# Altium project PID_controller.PrjPcb
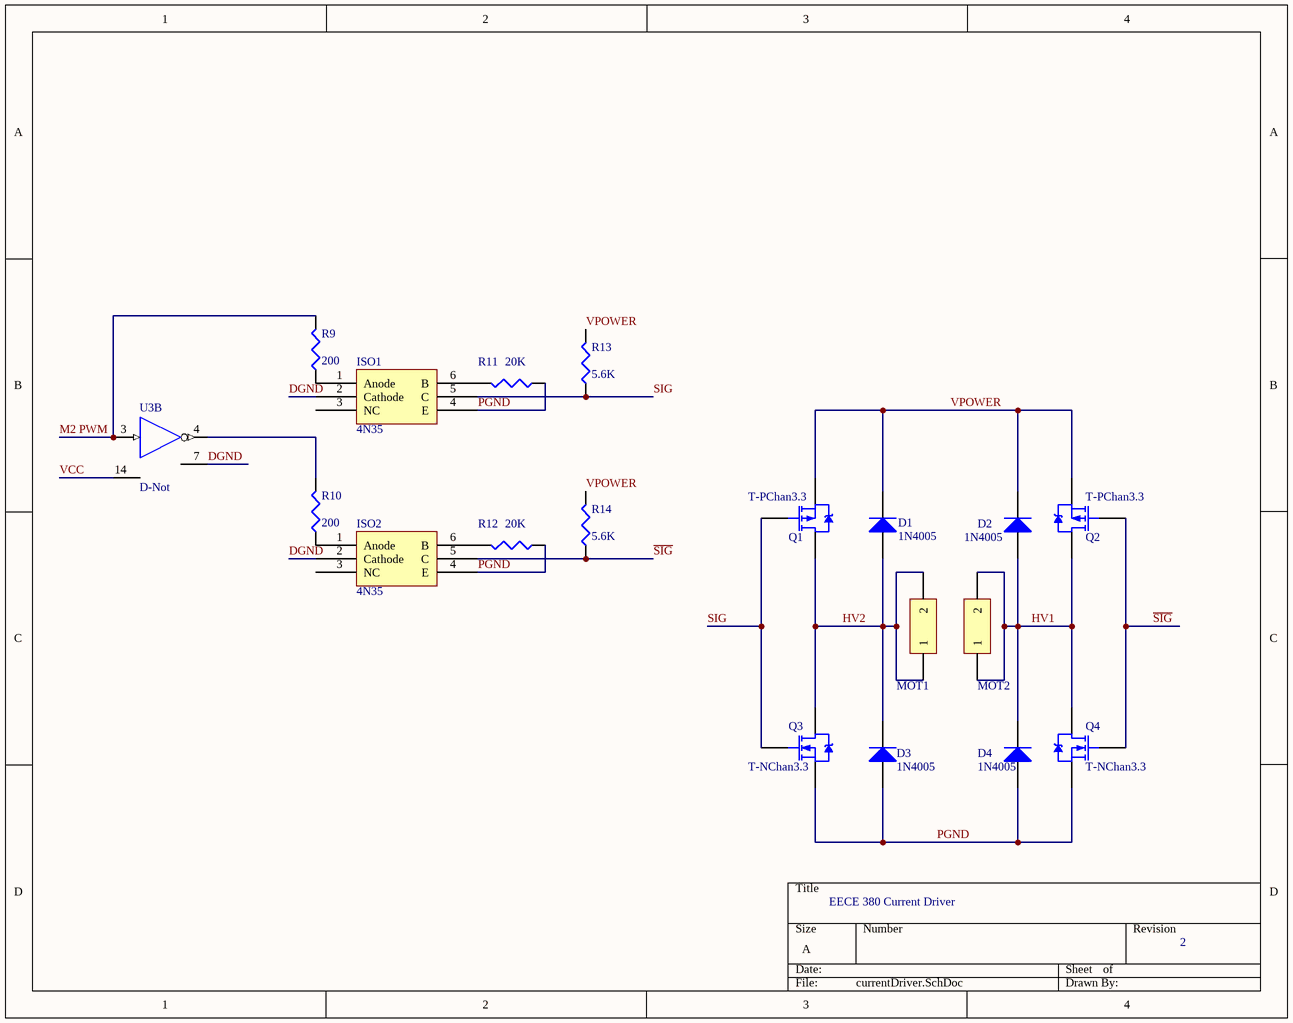
[diagram p0: currentDriver.SchDoc]
3 sheets, 45 parts. Net scope: global (net labels, ports and power ports of the same name join across sheets).
Board file: motherboard2.PcbDoc
Sheets:
  currentDriver.SchDoc
  opticalDecoder.SchDoc
  motherboard2.SchDoc

## Sheet currentDriver.SchDoc
size A

### Parts
D1  1N4005  [DO-41_XLGE1.2]
D2  1N4005  [DO-41_XLGE1.2]
D3  1N4005  [DO-41_XLGE1.2]
D4  1N4005  [DO-41_XLGE1.2]
ISO1  4N35  [DIP6LGE]
ISO2  4N35  [DIP6LGE]
MOT1  C-Ban  [Ban1cm_2XLGE1.5]  (value not drawn)
MOT2  Ban  [Ban1cm_2XLGE1.5]  (value not drawn)
Q1  T-PChan3.3  [TO-220AB]
Q2  T-PChan3.3  [TO-220AB]
Q3  T-NChan3.3  [TO-220AB]
Q4  T-NChan3.3  [TO-220AB]
R9  value 200  [Res10mm_LGE1.0]  (hidden comment: -Res)
R10  value 200  [Res10mm_LGE1.0]
R11  value 20K  [Res10mm_LGE1.0]  (hidden comment: G-Res)
R12  value 20K  [Res10mm_LGE1.0]  (hidden comment: G-Res)
R13  value 5.6K  [Res10mm_LGE1.0]  (hidden comment: G-Res)
R14  value 5.6K  [Res10mm_LGE1.0]  (hidden comment: G-Res)
U3  D-Not  [DIP14_LGE1.0]  (part B of 6)

### Nets
DGND: ISO1.2(Cathode) ISO2.2(Cathode) U3.7(GND)
HV1: D2.1(A) D4.2(K) MOT2.1 MOT2.2 Q2.2(D) Q4.2(D)
HV2: D1.1(A) D3.2(K) MOT1.1 MOT1.2 Q1.2(D) Q3.2(D)
M2 PWM: R9.2 U3.3(A)
PGND: D3.1(A) D4.1(A) ISO1.4(E) ISO2.4(E) Q3.3(S) Q4.3(S) R11.1 R12.1
~{SIG}: ISO2.5(C) Q2.1(G) Q4.1(G) R14.1
SIG: ISO1.5(C) Q1.1(G) Q3.1(G) R13.1
VCC: U3.14(VCC)  [project net V1]
VPOWER: D1.2(K) D2.2(K) Q1.3(S) Q2.3(S) R13.2 R14.2
NetISO1_1: ISO1.1(Anode) R9.1
NetISO1_6: ISO1.6(B) R11.2
NetISO2_1: ISO2.1(Anode) R10.1
NetISO2_6: ISO2.6(B) R12.2
NetR10_2: R10.2 U3.4(Y)

Not connected (* = marked no-connect by the designer): ISO1 3(NC); ISO2 3(NC)

### Notes on the sheet
- EECE 380 Current Driver
- 2

### Library data of the parts
D1-D4 = T-Diode-1N4005: diode; Published: 8-Jun-2000; LatestRevisionDate: 17-Jul-2002; LatestRevisionNote: Re-released for DXP Platform.; DatasheetDocument: 1998; PackageDocument: Aug-1999; PackageReference: DO-41; Publisher: Altium Limited; Code_JEDEC: DO-204-AL; ComponentLink1Description: Manufacturer Link; ComponentLink1URL: http://www.fairchildsemi.com/; ComponentLink2Description: Pinout Specification; ComponentLink2URL: http://www.fairchildsemi.com/ds/1N%2F1N4001.pdf
MOT1 MOT2 = C-Ban: Banana plug fem; LatestRevisionDate: 17-Jul-2002; LatestRevisionNote: Re-released for DXP Platform.; Publisher: Altium Limited
Q1 Q2 = T-PChan3.3: P-Channel Power MOSFET; Note: Pin 4 not drawn and electrically connected to Pin 2.; Published: 4-Nov-2002; PackageReference: TO-220AB; PackageDescription: TO, Thru-Hole, Vertical, Heatsink Mounted; 3 In-Line Leads; Pitch 2.54 mm; ComponentLink1URL: https://www.fairchildsemi.com/products/discretes/fets/mosfets/FQP7P06.html?keyword=FQP7P06
Q3 Q4 = T-NChan3.3: N-Channel Power MOSFET; Note: Pin 2 is electrically connected to pin 4.; Published: 23-Jan-2015; LatestRevisionDate: 23-Jan-2015; PackageReference: TO-220AB; PackageDescription: TO, Thru-Hole, Vertical, Heatsink Mounted; 3 In-Line Leads; Pitch 2.54 mm; ComponentLink1URL: http://www.vishay.com/product?docid=91023#psplib
R9-R14 = G-Res: resistor (specify value); Published: 8-Jun-2000; LatestRevisionDate: 29-May-2009; LatestRevisionNote: IPC-7351 Footprint Added.; PackageReference: J1-0603; Publisher: Altium Limited; PackageDescription: Chip Resistor
U3 = D-Not: hex NOT gate (inverter); Published: 8-Jun-2000; LatestRevisionDate: 04-Mar-2005; LatestRevisionNote: Stylized 3D Model Added.; DatasheetVersion: Mar-1988; PackageVersion: Oct-1995; PackageReference: N014; Publisher: Altium Limited; PackageDescription: DIP; 14 Leads; Row Spacing 7.62 mm; Pitch 2.54 mm; ComponentLink1Description: Manufacturer Link; ComponentLink1URL: http://www.ti.com/; ComponentLink2Description: Datasheet; ComponentLink2URL: http://www-s.ti.com/sc/ds/sn74ls04.pdf

## Sheet opticalDecoder.SchDoc
size A4
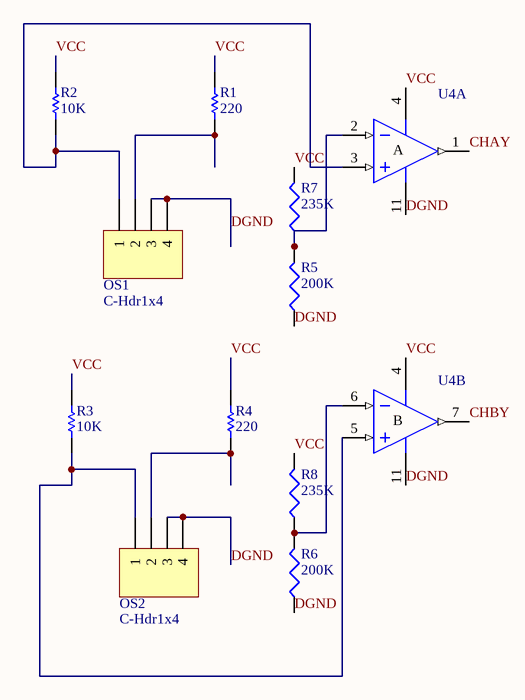
[diagram p1: opticalDecoder.SchDoc]

### Parts
OS1  C-Hdr1x4  [HDR1X4_LGE1.0]
OS2  C-Hdr1x4  [HDR1X4_LGE1.0]
R1  220  [Res10mm_LGE1.0]
R2  10K  [Res10mm_LGE1.0]
R3  10K  [Res10mm_LGE1.0]
R4  220  [Res10mm_LGE1.0]
R5  200K  [Res10mm_LGE1.0]
R6  200K  [Res10mm_LGE1.0]
R7  235K  [Res10mm_LGE1.0]
R8  235K  [Res10mm_LGE1.0]
U4  O-OpAmp074  [DIP14_LGE1.0]  (value not drawn)  (parts A,B of 4)

### Nets
CHAY: U4.1(OUT)
CHBY: U4.7(OUT)
DGND: OS1.3 OS1.4 OS2.3 OS2.4 R5.1 R6.1 U4.11(V-)
VCC: R1.2 R2.2 R3.2 R4.2 R7.2 R8.2 U4.4(V+)  [project net V1]
NetOS1_1: OS1.1 R2.1 U4.3(IN+)
NetOS1_2: OS1.2 R1.1
NetOS2_1: OS2.1 R3.1 U4.5(IN+)
NetOS2_2: OS2.2 R4.1
NetR5_2: R5.2 R7.1 U4.2(IN-)
NetR6_2: R6.2 R8.1 U4.6(IN-)

### Notes on the sheet
- (in symbol O-OpAmp074, part A) A
- (in symbol O-OpAmp074, part B) B

### Library data of the parts
OS1 OS2 = C-Hdr1x4: Header, 4-Pin; LatestRevisionDate: 17-Jul-2002; LatestRevisionNote: Re-released for DXP Platform.; Publisher: Altium Limited
R1-R4 = Res1: Resistor; Published: 8-Jun-2000; LatestRevisionDate: 17-Jul-2002; LatestRevisionNote: Re-released for DXP Platform.; PackageReference: AXIAL-0.3; Publisher: Altium Limited; PackageDescription: Axial Device, Thru-Hole; 2 Leads; 0.3 in Pin Spacing
  R1 R4: Value: 220
  R2 R3: Value: 10K
R5-R8 = G-Res: resistor (specify value); Published: 8-Jun-2000; LatestRevisionDate: 29-May-2009; LatestRevisionNote: IPC-7351 Footprint Added.; PackageReference: J1-0603; Publisher: Altium Limited; PackageDescription: Chip Resistor
  R5 R6: Value: 200K
  R7 R8: Value: 235K
U4 = O-OpAmp074: op amp (TL074); Published: 24-Aug-2001; LatestRevisionDate: 06-Jun-2005; LatestRevisionNote: Stylized 3D Model Added.; DatasheetVersion: Dec-1998; PackageVersion: Jan-1997; PackageReference: DIP14; Publisher: Altium Limited; PackageDescription: DIP; 14 Leads; Row Spacing 7.62 mm; Pitch 2.54 mm; ComponentLink1Description: Manufacturer Link; ComponentLink1URL: http://www.st.com/; ComponentLink2Description: Datasheet; ComponentLink2URL: http://www.st.com/stonline/products/literature/ds/2297/tl074.pdf

## Sheet motherboard2.SchDoc
size A
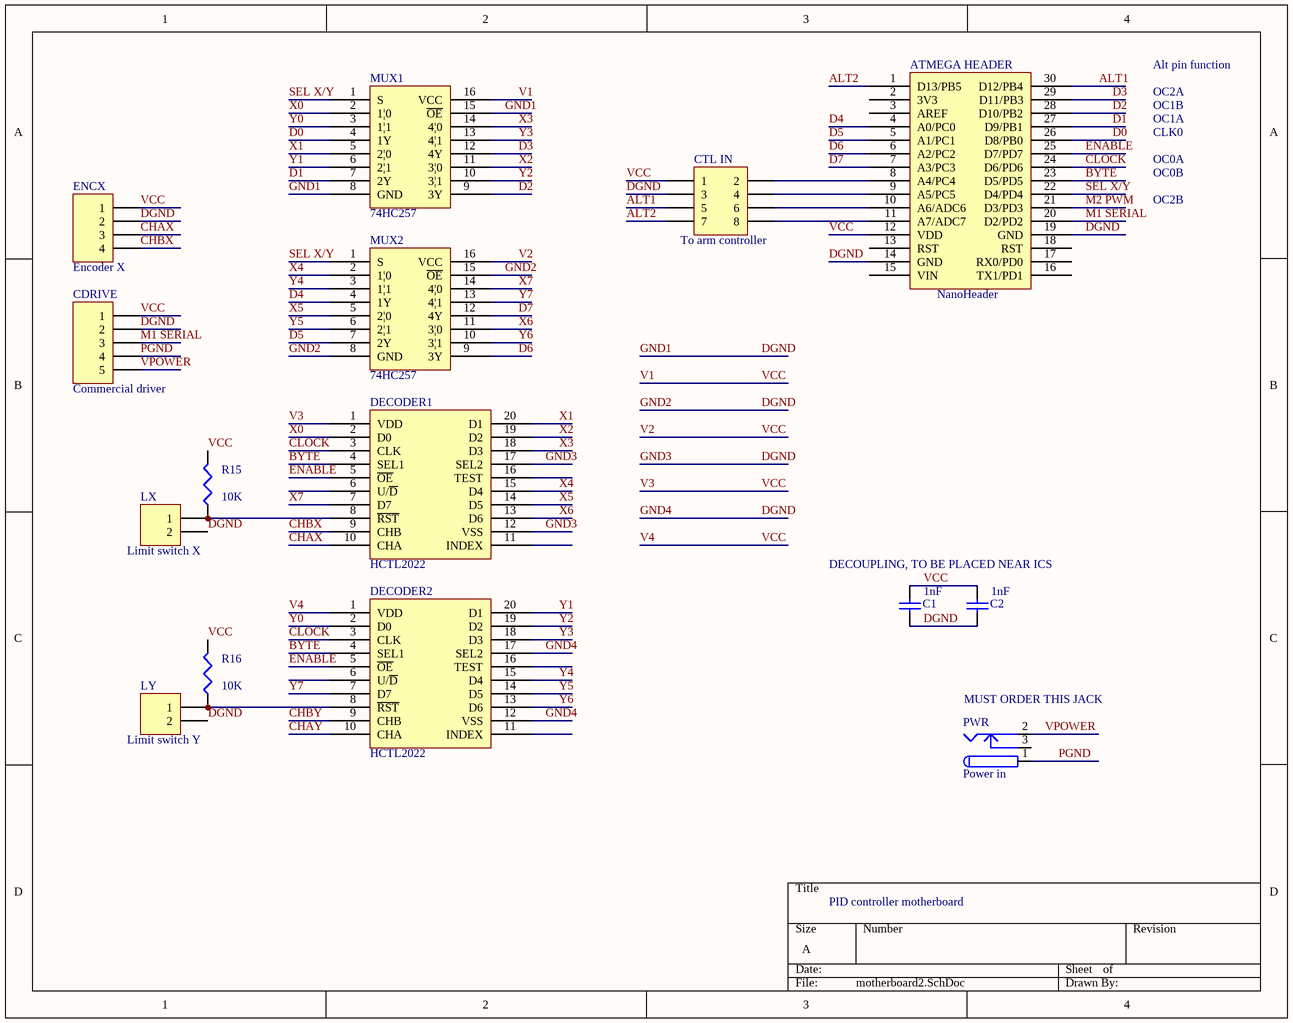
[diagram p2: motherboard2.SchDoc]

### Parts
ATMEGA_HEADER  NanoHeader  [DIP30W]
C1  value 1nF  [RAD-0.3]
C2  value 1nF  [RAD-0.3]
CDRIVE  Commercial driver  [HDR1X5_LGE1.0]
CTL_IN  To arm controller  [HDR2X4_LGE1.0]
DECODER1  HCTL2022  [N020D_LGE1.0]
DECODER2  HCTL2022  [N020D_LGE1.0]
ENCX  Encoder X  [HDR1X4_LGE1.0]
LX  Limit switch X  [HDR1X2_LGE1.0]
LY  Limit switch Y  [HDR1X2_LGE1.0]
MUX1  74HC257  [DIP16_LGE1.0]
MUX2  74HC257  [DIP16_LGE1.0]
PWR  Power in  [KLD_XLGE1.2]
R15  value 10K  [Res10mm_LGE1.0]
R16  value 10K  [Res10mm_LGE1.0]

### Nets
ALT1: ATMEGA_HEADER.30(D12/PB4) CTL_IN.5
ALT2: ATMEGA_HEADER.1(D13/PB5) CTL_IN.7
BYTE: ATMEGA_HEADER.23(D5/PD5) DECODER1.4(SEL1) DECODER2.4(SEL1)
CHAX: DECODER1.10(CHA) ENCX.3
CHAY: DECODER2.10(CHA)
CHBX: DECODER1.9(CHB) ENCX.4
CHBY: DECODER2.9(CHB)
CLOCK: ATMEGA_HEADER.24(D6/PD6) DECODER1.3(CLK) DECODER2.3(CLK)
D0: ATMEGA_HEADER.26(D8/PB0) MUX1.4(1Y)
D1: ATMEGA_HEADER.27(D9/PB1) MUX1.7(2Y)
D2: ATMEGA_HEADER.28(D10/PB2) MUX1.9(3Y)
D3: ATMEGA_HEADER.29(D11/PB3) MUX1.12(4Y)
D4: ATMEGA_HEADER.4(A0/PC0) MUX2.4(1Y)
D5: ATMEGA_HEADER.5(A1/PC1) MUX2.7(2Y)
D6: ATMEGA_HEADER.6(A2/PC2) MUX2.9(3Y)
D7: ATMEGA_HEADER.7(A3/PC3) MUX2.12(4Y)
DGND: ATMEGA_HEADER.14(GND) ATMEGA_HEADER.19(GND) C1.1 C2.1 CDRIVE.2 CTL_IN.3 DECODER1.12(VSS) DECODER1.17(SEL2) DECODER2.12(VSS) DECODER2.17(SEL2) ENCX.2 LX.2 LY.2 MUX1.8(GND) MUX1.15(~{OE}) MUX2.8(GND) MUX2.15(~{OE})  [also labelled GND1, GND2, GND3, GND4]
ENABLE: ATMEGA_HEADER.25(D7/PD7) DECODER1.5(~{OE}) DECODER2.5(~{OE})
M1 SERIAL: ATMEGA_HEADER.20(D2/PD2) CDRIVE.3
M2 PWM: ATMEGA_HEADER.21(D3/PD3)
PGND: CDRIVE.4 PWR.1
SEL X/Y: ATMEGA_HEADER.22(D4/PD4) MUX1.1(S) MUX2.1(S)
V1: ATMEGA_HEADER.12(VDD) C1.2 C2.2 CDRIVE.1 CTL_IN.1 DECODER1.1(VDD) DECODER2.1(VDD) ENCX.1 MUX1.16(VCC) MUX2.16(VCC) R15.2 R16.2  [also labelled V2, V3, V4, VCC]
VPOWER: CDRIVE.5 PWR.2
X0: DECODER1.2(D0) MUX1.2(1|0)
X1: DECODER1.20(D1) MUX1.5(2|0)
X2: DECODER1.19(D2) MUX1.11(3|0)
X3: DECODER1.18(D3) MUX1.14(4|0)
X4: DECODER1.15(D4) MUX2.2(1|0)
X5: DECODER1.14(D5) MUX2.5(2|0)
X6: DECODER1.13(D6) MUX2.11(3|0)
X7: DECODER1.7(D7) MUX2.14(4|0)
Y0: DECODER2.2(D0) MUX1.3(1|1)
Y1: DECODER2.20(D1) MUX1.6(2|1)
Y2: DECODER2.19(D2) MUX1.10(3|1)
Y3: DECODER2.18(D3) MUX1.13(4|1)
Y4: DECODER2.15(D4) MUX2.3(1|1)
Y5: DECODER2.14(D5) MUX2.6(2|1)
Y6: DECODER2.13(D6) MUX2.10(3|1)
Y7: DECODER2.7(D7) MUX2.13(4|1)
NetATMEGA_HEADER_8: ATMEGA_HEADER.8(A4/PC4) CTL_IN.2
NetATMEGA_HEADER_9: ATMEGA_HEADER.9(A5/PC5) CTL_IN.4
NetATMEGA_HEADER_10: ATMEGA_HEADER.10(A6/ADC6) CTL_IN.6
NetATMEGA_HEADER_11: ATMEGA_HEADER.11(A7/ADC7) CTL_IN.8
NetDECODER1_8: DECODER1.8(~{RST}) LX.1 R15.1
NetDECODER2_8: DECODER2.8(~{RST}) LY.1 R16.1

Not connected (* = marked no-connect by the designer): ATMEGA_HEADER 2(3V3) 3(AREF) 13(RST) 15(VIN) 16(TX1/PD1) 17(RX0/PD0) 18(RST); DECODER1 6(U/~{D}) 11(INDEX) 16(TEST); DECODER2 6(U/~{D}) 11(INDEX) 16(TEST); PWR 3

### Notes on the sheet
- OC2A
- Alt pin function
- OC0A
- CLK0
- OC1A
- OC1B
- OC0B
- OC2B
- DECOUPLING, TO BE PLACED NEAR ICS
- (near PWR) MUST ORDER THIS JACK
- PID controller motherboard

### Library data of the parts
C1 C2 = Cap: Capacitor; Published: 8-Jun-2000; LatestRevisionDate: 17-Jul-2002; LatestRevisionNote: Re-released for DXP Platform.; PackageReference: RAD-0.3; Publisher: Altium Limited; PackageDescription: Radial Cap, Thru-Hole; 2 Leads; 0.3 in Pin Spacing
CDRIVE = C-Hdr1x5: Header, 6-Pin; LatestRevisionDate: 17-Jul-2002; LatestRevisionNote: Re-released for DXP Platform.; Publisher: Altium Limited
CTL_IN = C-Hdr2x4: Header, 4-Pin, Dual row; LatestRevisionDate: 17-Jul-2002; LatestRevisionNote: Re-released for DXP Platform.; Publisher: Altium Limited
ENCX = C-Hdr1x4: Header, 4-Pin; LatestRevisionDate: 17-Jul-2002; LatestRevisionNote: Re-released for DXP Platform.; Publisher: Altium Limited
LX LY = C-Hdr1x2: Header, 2-Pin; LatestRevisionDate: 17-Jul-2002; LatestRevisionNote: Re-released for DXP Platform.; Publisher: Altium Limited
PWR = Power in: Low Voltage Power Supply Connector; Published: 17-Dec-2003; DatasheetDocument: 09-May-2002; Publisher: Altium Limited; ComponentLink1Description: Manufacturer Link; ComponentLink1URL: http://domino.kycon.com/internet/Products.html
R15 R16 = G-Res: resistor (specify value); Published: 8-Jun-2000; LatestRevisionDate: 29-May-2009; LatestRevisionNote: IPC-7351 Footprint Added.; PackageReference: J1-0603; Publisher: Altium Limited; PackageDescription: Chip Resistor

## Nets that join several sheets
CHAY: opticalDecoder (U4.1), motherboard2 (DECODER2.10)
CHBY: opticalDecoder (U4.7), motherboard2 (DECODER2.9)
DGND: currentDriver (ISO1.2 ISO2.2 U3.7), opticalDecoder (7 pins), motherboard2 (17 pins)
M2 PWM: currentDriver (R9.2 U3.3), motherboard2 (ATMEGA_HEADER.21)
PGND: currentDriver (8 pins), motherboard2 (CDRIVE.4 PWR.1)
V1: currentDriver (U3.14), opticalDecoder (7 pins), motherboard2 (12 pins)
VPOWER: currentDriver (6 pins), motherboard2 (CDRIVE.5 PWR.2)